# Altium project TapBand.PrjPcb
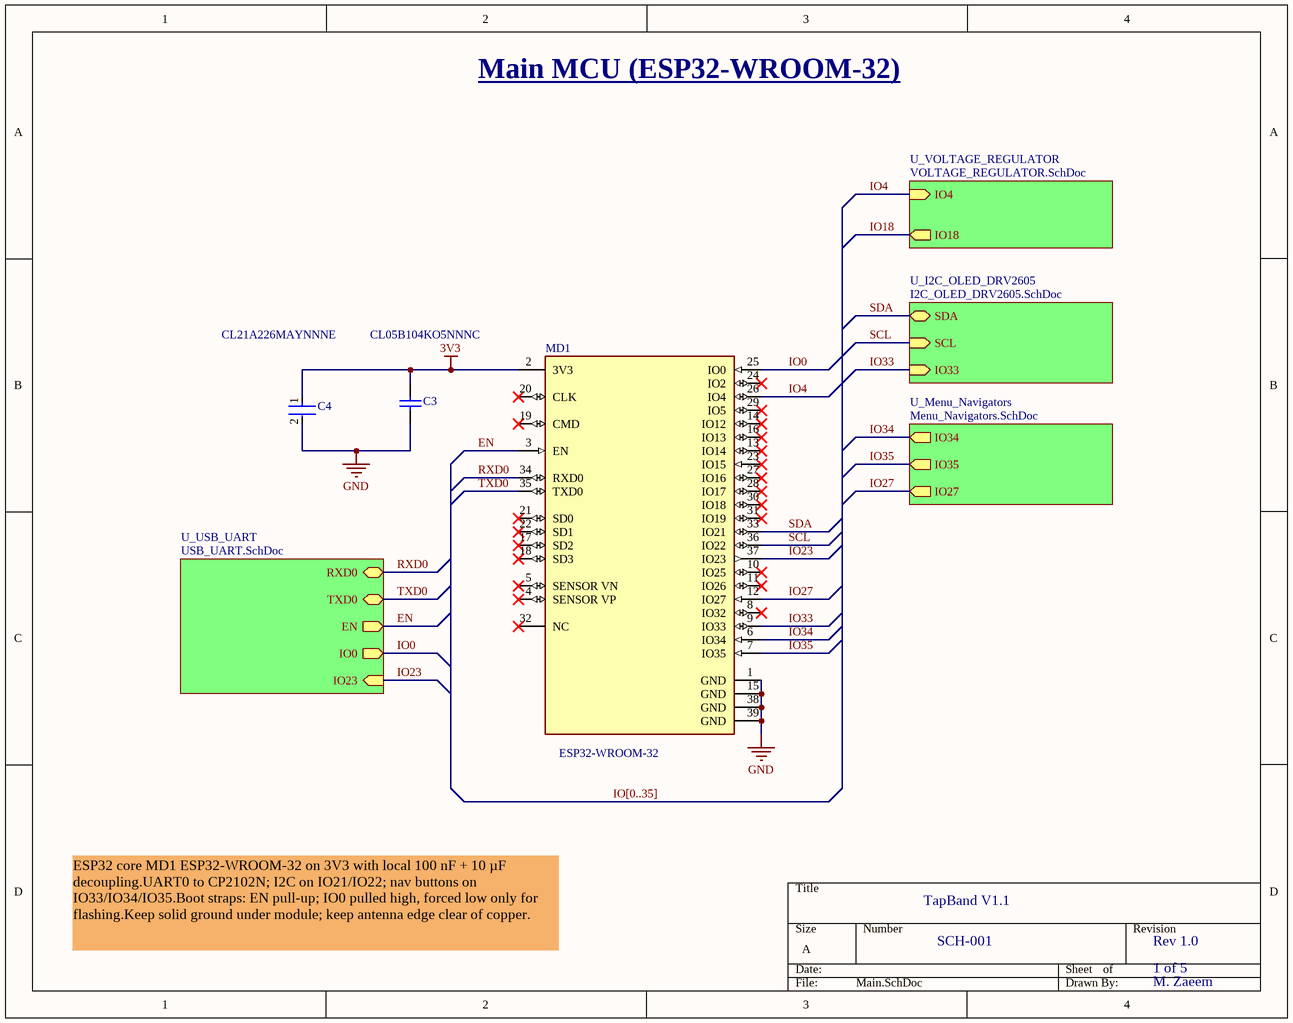
[diagram p0: Main.SchDoc]
5 sheets, 73 parts. Net scope: hierarchical (ports join the sheet entries above them; power ports are global).
Board file: TapBand.PcbDoc
Sheets:
  Main.SchDoc
    U_I2C_OLED_DRV2605 = I2C_OLED_DRV2605.SchDoc
    U_Menu_Navigators = Menu_Navigators.SchDoc
    U_USB_UART = USB_UART.SchDoc
    U_VOLTAGE_REGULATOR = VOLTAGE_REGULATOR.SchDoc

## Sheet Main.SchDoc
size A; SheetNumber: 1; SheetTotal: 5

### Parts
C3  CL05B104KO5NNNC  [CAPC1050X55X23ML05T13]
C4  CL21A226MAYNNNE  [FP-CL21-IPC_C]
MD1  ESP32-WROOM-32  [FP-ESP32-WROOM-32-MFG]

### Sub-sheets
U_I2C_OLED_DRV2605 = I2C_OLED_DRV2605.SchDoc: SDA (bidir), SCL (in), IO33 (in)
U_Menu_Navigators = Menu_Navigators.SchDoc: IO27 (out), IO34 (out), IO35 (out)
U_USB_UART = USB_UART.SchDoc: IO0 (out), EN (out), IO23 (in), RXD0 (bidir), TXD0 (bidir)
U_VOLTAGE_REGULATOR = VOLTAGE_REGULATOR.SchDoc: IO4 (in), IO18 (out)

### Nets
3V3: C3.2 C4.1 MD1.2(3V3)
GND: C3.1 C4.2 MD1.1(GND) MD1.15(GND) MD1.38(GND) MD1.39(GND)
EN: MD1.3(EN) ; sheet U_USB_UART/EN
IO0: MD1.25(IO0) ; sheet U_USB_UART/IO0
IO4: MD1.26(IO4) ; sheet U_VOLTAGE_REGULATOR/IO4
IO23: MD1.37(IO23) ; sheet U_USB_UART/IO23
IO27: MD1.12(IO27) ; sheet U_Menu_Navigators/IO27
IO33: MD1.9(IO33) ; sheet U_I2C_OLED_DRV2605/IO33
IO34: MD1.6(IO34) ; sheet U_Menu_Navigators/IO34
IO35: MD1.7(IO35) ; sheet U_Menu_Navigators/IO35
RXD0: MD1.34(RXD0) ; sheet U_USB_UART/RXD0
SCL: MD1.36(IO22) ; sheet U_I2C_OLED_DRV2605/SCL
SDA: MD1.33(IO21) ; sheet U_I2C_OLED_DRV2605/SDA
TXD0: MD1.35(TXD0) ; sheet U_USB_UART/TXD0

Not connected (* = marked no-connect by the designer): MD1 4(SENSOR_VP)* 5(SENSOR_VN)* 8(IO32)* 10(IO25)* 11(IO26)* 13(IO14)* 14(IO12)* 16(IO13)* 17(SD2)* 18(SD3)* 19(CMD)* 20(CLK)* 21(SD0)* 22(SD1)* 23(IO15)* 24(IO2)* 27(IO16)* 28(IO17)* 29(IO5)* 30(IO18)* 31(IO19)* 32(NC)*

### Buses and harness runs
bus IO[0..35]

### Notes on the sheet
- Main MCU (ESP32-WROOM-32)
- TapBand V1.1
- ESP32 core MD1 ESP32‑WROOM‑32 on 3V3 with local 100 nF + 10 µF decoupling.UART0 to CP2102N; I2C on IO21/IO22; nav buttons on IO33/IO34/IO35.Boot straps: EN pull‑up; IO0 pulled high, forced low only for flashing.Keep solid ground under module; keep antenna edge clear of copper.
- SCH-001
- Rev 1.0
- 1 of 5
- M. Zaeem

### Library data of the parts
C3 = CMP-2000-05439-1: Chip Capacitor, 100 nF, +/- 10%, 16 V, -55 to 125 degC, 0402 (1005 Metric), RoHS, Tape and Reel; Manufacturer: Samsung Electro-Mechanics; Capacitance: 100000pF; Dielectric: X7R; Rated Voltage: 16V; Case Size/Dimension: 0402; Tolerance (%): ±10%; Manufacturer URL: http://www.samsungsem.com/global/index.jsp; Datasheet URL: https://datasheet.ciiva.com/29198/458718-da-01-en-vs-kondensator-0402-29198423.pdf; Datasheet Version: Nov-10
C4 = CMP-13271-003225-1: CL21 Series 0805 22uF 25V ±20% Tolerance X5R Multilayer Ceramic Chip Capacitor
MD1 = CMP-194065-000008-1: RX TXRX MOD WIFI SURFACE MOUNT; Frequency: 2.5GHz; Sensitivity: -98dBm; Operating Supply Voltage: 3.6V; Data Rate: 150Mbps; Weight: 0.088185oz; Package Quantity: 550; Min Operating Temperature: -40°C; Mount: Surface Mount; Max Operating Temperature: 85°C; Packaging: Cut Tape; Case/Package: SMD/SMT

## Sheet I2C_OLED_DRV2605.SchDoc
size A; SheetNumber: 2; SheetTotal: 5
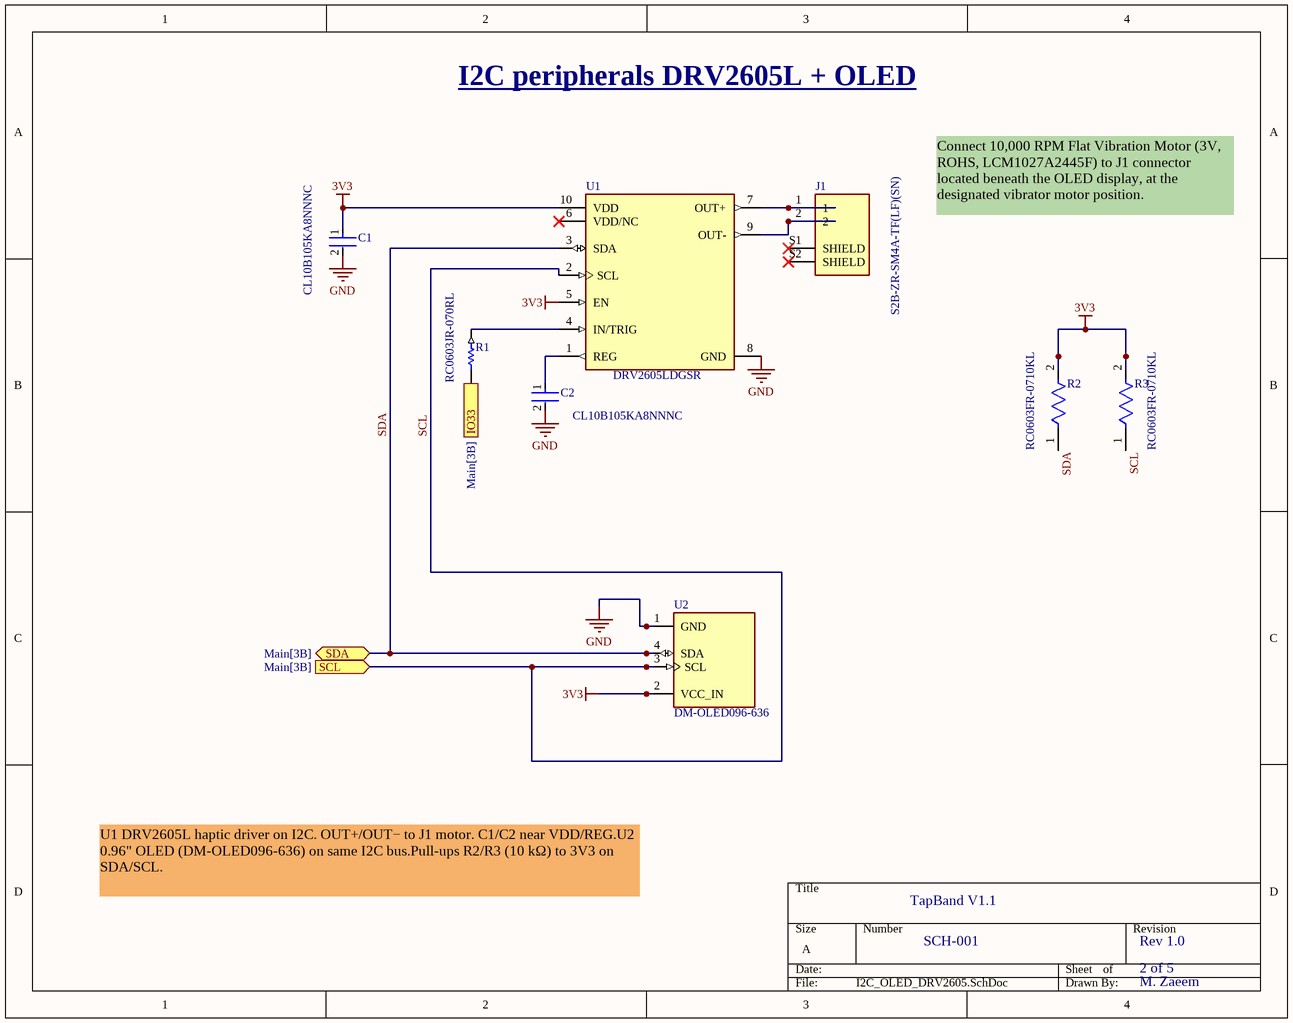
[diagram p1: I2C_OLED_DRV2605.SchDoc]

### Parts
C1  CL10B105KA8NNNC  [FP-CL10-IPC_C]
C2  CL10B105KA8NNNC  [FP-CL10-IPC_C]
J1  S2B-ZR-SM4A-TF(LF)(SN)  [JST_S2B-ZR-SM4A-TF(LF)(SN)]
R1  RC0603JR-070RL  [RESC1608X55X25ML10T15]
R2  RC0603FR-0710KL  [FP-RC0603-0_55-IPC_C]
R3  RC0603FR-0710KL  [FP-RC0603-0_55-IPC_C]
U1  DRV2605LDGSR  [FP-DGS0010A-MFG]
U2  DM-OLED096-636  [MODULE_DM-OLED096-636]

### Ports
IO33 (in, see Main[3B]), SCL (in, see Main[3B]), SDA (bidir, see Main[3B])

### Nets
3V3: C1.1 R2.2 R3.2 U1.5(EN) U1.10(VDD) U2.2(VCC_IN)
GND: C1.2 C2.2 U1.8(GND) U2.1(GND)
IO33: R1.2 ; port IO33
SCL: R3.1 U1.2(SCL) U2.3(SCL) ; port SCL
SDA: R2.1 U1.3(SDA) U2.4(SDA) ; port SDA
NetC2_1: C2.1 U1.1(REG)
NetJ1_1: J1.1 U1.7(OUT+)
NetJ1_2: J1.2 U1.9(OUT-)
NetR1_1: R1.1 U1.4(IN/TRIG)

Not connected (* = marked no-connect by the designer): J1 S1(SHIELD)* S2(SHIELD)*; U1 6(VDD/NC)*

### Notes on the sheet
- I2C peripherals DRV2605L + OLED
- Connect 10,000 RPM Flat Vibration Motor (3V, ROHS, LCM1027A2445F) to J1 connector located beneath the OLED display, at the designated vibrator motor position.
- U1 DRV2605L haptic driver on I2C. OUT+/OUT− to J1 motor. C1/C2 near VDD/REG.U2 0.96" OLED (DM‑OLED096‑636) on same I2C bus.Pull‑ups R2/R3 (10 kΩ) to 3V3 on SDA/SCL.
- TapBand V1.1
- SCH-001
- Rev 1.0
- 2 of 5
- M. Zaeem

### Library data of the parts
C1 C2 = CMP-13271-000007-2: CAP CER 1UF 25V X7R 0603; Tolerance: 10%; Width: 0.031inch; Packaging: Tape and Reel; Package Quantity: 1; Case/Package: 0603; Series: CL; Case Code (Imperial): 0603; Radiation Hardening: No; Thickness: 0.035inch; Case Code (Metric): 1608; Min Operating Temperature: -55°C; Depth: 0.8mm; RoHS Compliant: Yes; Height: 0.8mm; Capacitance: 1uF; Mount: Surface Mount; Construction: Flat; Length: 1.6mm; Max Operating Temperature: 125°C; Voltage: 25V; Dielectric: X7R; Contact Plating: Tin; Voltage Rating: 25V
J1 = S2B-ZR-SM4A-TF(LF)(SN): Connector Header Surface Mount, Right Angle 2 position 0.059 (1.50mm); MF: JST Sales; SnapEDA_Link: https://www.snapeda.com/parts/S2B-ZR-SM4A-TF%20(LF)(SN)/JST/view-part/?ref=snap; Package: None; Value: *; MP: S2B-ZR-SM4A-TF (LF)(SN); Check_prices: https://www.snapeda.com/parts/S2B-ZR-SM4A-TF%20(LF)(SN)/JST/view-part/?ref=eda
R1 = CMP-2100-03667-1: Chip Resistor, 0 Ohm, +/- 5%, 0.1 W, -55 to 155 degC, 0603 (1608 Metric), RoHS, Tape and Reel; Manufacturer: Yageo; Temperature Coefficient: 200ppm/degreesC; Voltage Rating: 50V; Power Rating: 100mW; Resistance: 0mOhm; Width: 0.8mm; Max Operating Temperature: 155degC; Tolerance: 5%; Package Reference: 0603; Height: 0.45mm; Depth: 0.8mm; Package Description: 2-Pin Surface Mount Device, Body 1.6 x 0.8 mm; Termination: SMD/SMT; Package Quantity: 5000; Case/Package: 0603; Case Code (Imperial): 0603; Radiation Hardening: No; Number of Pins: 2; Length: 1.6mm; Lead Free: LeadFree; Voltage Rating (DC): 50V; Military Standard: Not; Datasheet URL: http://www.yageo.com/NewPortal/yageodocoutput?fileName=/pdf/R-Chip/PYu-RC_Group_51_RoHS_L_5.pdf; Manufacturer URL: http://www.yageo.com/; Packaging: TapeandReel; Case Code (Metric): 1608; Min Operating Temperature: -55degC; Composition: ThickFilm; RoHSCompliant: true; Contact Plating: Tin; Datasheet Version: Rev. 5, 10/2016; REACH SVHC: NoSVHC
R2 R3 = CMP-2100-03664-2: RES 10K OHM 1% 1/10W 0603; Voltage Rating: 75V; Voltage Rating (DC): 50V; Resistance: 10kR; Power Rating: 100mW; Temperature Coefficient: 100ppm/°C; Depth: 0.8mm; Termination: SMD/SMT; Resistor Type: Thick Film; Series: RC; Construction: Rectangular; Features: Moisture Resistant; Packaging: Tape and Reel; Min Operating Temperature: -55°C; Number of Terminations: 2; Lead Pitch: 0.3mm; RoHS Compliant: Yes; Case/Package: 0603; Resistance Tolerance: 1%; Military Standard: Not; Weight: 7.1E-05oz; Number of Pins: 2; Tolerance: 1%; Length: 1.6mm; Case Code (Imperial): 0603; Lead Free: Lead Free; Width: 0.8mm; Max Power Dissipation: 100mW; Height: 0.45mm; Max Operating Temperature: 155°C; Case Code (Metric): 1608; Size Code: 0603
U1 = CMP-04915-000060-1: IC MOTOR DRIVER 2V-5.5V 10VSSOP; Logic Function: AND GATE; Quiescent Current: 500uA; Interface: I2C; RoHS Compliant: Yes; Min Operating Temperature: -40°C; Max Operating Temperature: 85°C; Packaging: Tape and Reel; Lead Free: Lead Free; Case/Package: VSSOP; Mount: Surface Mount
U2 = DM-OLED096-636: 0.96â€ 128 X 64 MONOCHROME GRAPHIC OLED DISPLAY MODULE - I2C; SnapEDA_Link: https://www.snapeda.com/parts/DM-OLED096-636/Display+Module/view-part/?ref=snap; Package: Package; Value: *; MF: Display Module; MP: DM-OLED096-636; Check_prices: https://www.snapeda.com/parts/DM-OLED096-636/Display+Module/view-part/?ref=eda

## Sheet Menu_Navigators.SchDoc
size A; SheetNumber: 5; SheetTotal: 5
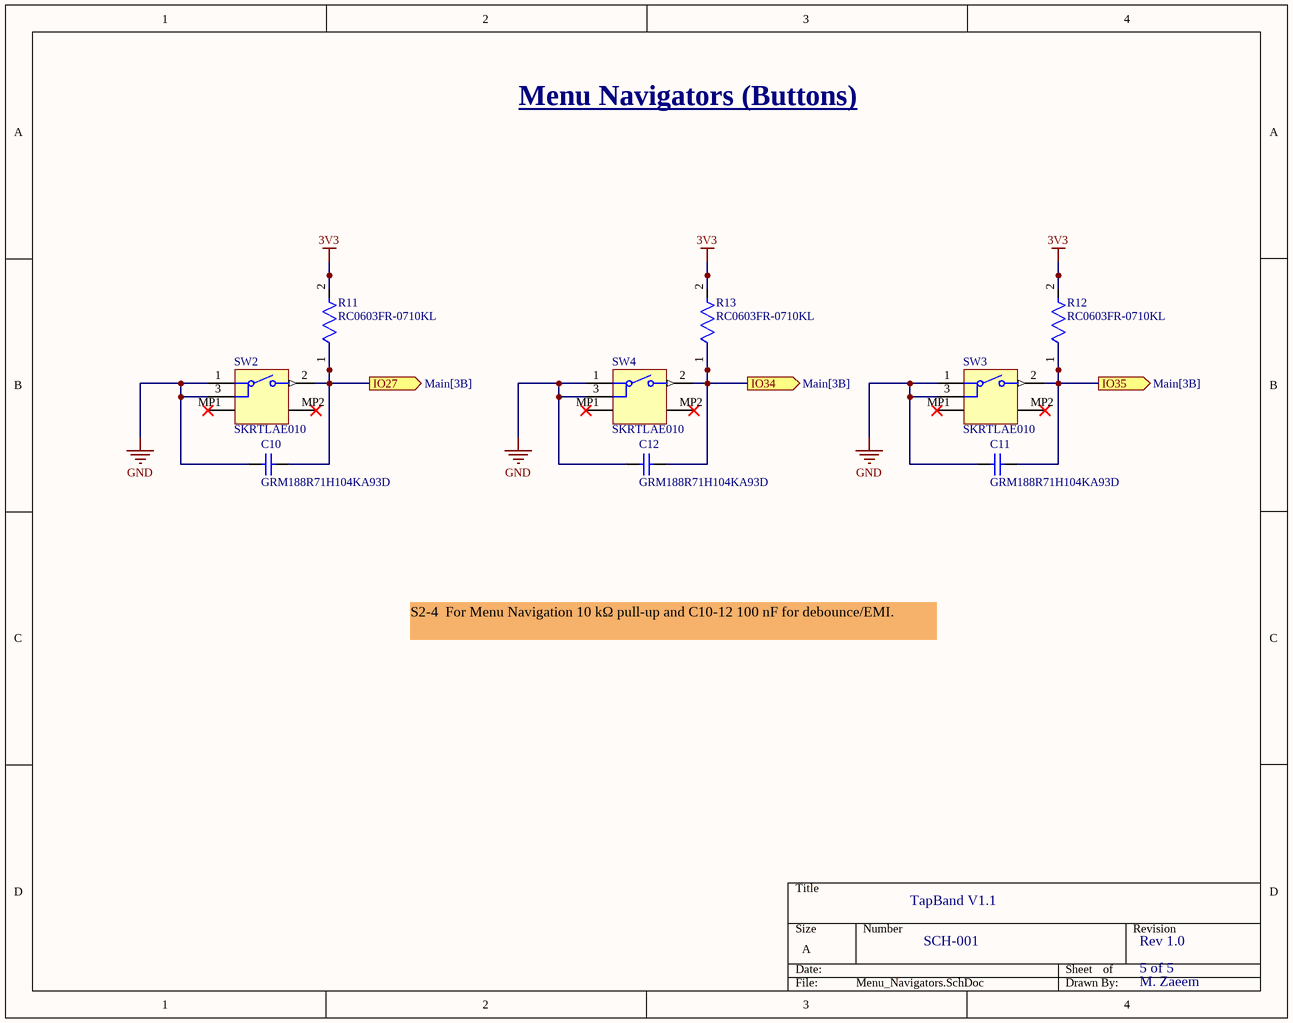
[diagram p2: Menu_Navigators.SchDoc]

### Parts
C10  GRM188R71H104KA93D  [CAPC1608X90X35ML10T15]
C11  GRM188R71H104KA93D  [CAPC1608X90X35ML10T15]
C12  GRM188R71H104KA93D  [CAPC1608X90X35ML10T15]
R11  RC0603FR-0710KL  [FP-RC0603-0_55-IPC_C]
R12  RC0603FR-0710KL  [FP-RC0603-0_55-IPC_C]
R13  RC0603FR-0710KL  [FP-RC0603-0_55-IPC_C]
SW2  SKRTLAE010  [ALPS-SKRTLAE010_V]
SW3  SKRTLAE010  [ALPS-SKRTLAE010_V]
SW4  SKRTLAE010  [ALPS-SKRTLAE010_V]

### Ports
IO27 (out, see Main[3B]), IO34 (out, see Main[3B]), IO35 (out, see Main[3B])

### Nets
3V3: R11.2 R12.2 R13.2
GND: C10.2 C11.2 C12.2 SW2.1 SW2.3 SW3.1 SW3.3 SW4.1 SW4.3
IO27: C10.1 R11.1 SW2.2 ; port IO27
IO34: C12.1 R13.1 SW4.2 ; port IO34
IO35: C11.1 R12.1 SW3.2 ; port IO35

Not connected (* = marked no-connect by the designer): SW2 MP1* MP2*; SW3 MP1* MP2*; SW4 MP1* MP2*

### Notes on the sheet
- Menu Navigators (Buttons)
- S2-4  For Menu Navigation 10 kΩ pull‑up and C10-12 100 nF for debounce/EMI.
- TapBand V1.1
- SCH-001
- Rev 1.0
- 5 of 5
- M. Zaeem

### Library data of the parts
C10-C12 = CMP-2100-03643-1: Chip Capacitor, 0.1 uF, +/- 10%, 50 V, -55 to 125 degC, 0603 (1608 Metric), RoHS, Tape and Reel; Manufacturer: Murata; Dielectric Material: Ceramic; Voltage Rating: 50V; Capacitance: 100nF; Dielectric: X7R; Insulation Resistance: 10GR; Case Code (Metric): 1608; Lead Free: LeadFree; Depth: 0.8mm; Number of Pins: 2; Radiation Hardening: No; Case/Package: 0603; Manufacturer URL: http://www.murata.com/; Packaging: TapeandReel; Length: 1.6mm; Contact Plating: Tin; Datasheet URL: http://psearch.en.murata.com/capacitor/product/GRM188R71H104KA93%23.pdf; Tolerance: 10%; Case Code (Imperial): 0603; Min Operating Temperature: -55degC; RoHSCompliant: true; Voltage: 50V; Termination: SMD/SMT; Mount: SurfaceMount; Material: Ceramic; Package Quantity: 1; Height: 0.8mm; Thickness: 0.035inch; REACH SVHC: NoSVHC; Max Operating Temperature: 125degC; Width: 0.8mm; Package Reference: 0603; Voltage Rating (DC): 50V; Datasheet Version: 42675.0; Package Description: 2-Pin Surface Mount Device, Body 1.6 x 0.8 mm
R11-R13 = CMP-2100-03664-2: as R2 on sheet I2C_OLED_DRV2605; Depth: 0.8mm; Termination: SMD/SMT; Resistor Type: Thick Film; Series: RC; Construction: Rectangular; Features: Moisture Resistant; Packaging: Tape and Reel; Min Operating Temperature: -55°C; Number of Terminations: 2; Lead Pitch: 0.3mm; RoHS Compliant: Yes; Case/Package: 0603; Resistance Tolerance: 1%; Military Standard: Not; Weight: 7.1E-05oz; Number of Pins: 2; Tolerance: 1%; Length: 1.6mm; Case Code (Imperial): 0603; Lead Free: Lead Free; Width: 0.8mm; Max Power Dissipation: 100mW; Height: 0.45mm; Max Operating Temperature: 155°C; Case Code (Metric): 1608; Size Code: 0603
SW2-SW4 = CMP-2000-07073-2: Side Push Type, 250 V, -40 to 90 degC, 3-Pin SMD, RoHS, Tape and Reel; Manufacturer: ALPS; Operating Force: 1.6N; Folder: Unified Components\Components\New Releases\New\; Maximum Current Rating: 0.05@12VDCA; RevisionId: 1; Pole Throw Configuration: SPST; Switch Configuration: N.O.; AccessRights: 2147483647; Maximum DC Voltage Rating: 12V; ContentType: Unified Component; Rad Hard: No; Mounting: SurfaceMount; Datasheet URL: http://www.alps.com/prod/info/E/PDF/Tact/SurfaceMount/SKRT/SKRT.PDF; Manufacturer URL: http://www.alps.com/e/; ReleaseDate: 22/09/2017 06:13:25 AM; ItemHRID: CMP-2000-07073; ContentTypeGUID: CB3C11C4-E317-11DF-B822-12313F0024A2; LifeCycle: Released; ItemGUID: EAC55BEC-37DC-4BDB-8BA7-D75E6D5C3D75; Packaging: Tape&Reel; Package Reference: SKRTLAE010; FolderGUID: B7F4506A-9127-42E7-A087-46FE7B18D116; Datasheet Version: 06/2015; Mounting Technology: SurfaceMount; LifeCycleStateGUID: 61E382EE-6656-4F12-9E24-BE9327104A25; Package Description: 3-Pin Surface Mount Device, Body 4.5 x 3.55 mm, Pitch 1.225 mm

## Sheet USB_UART.SchDoc
size A; SheetNumber: 3; SheetTotal: 5
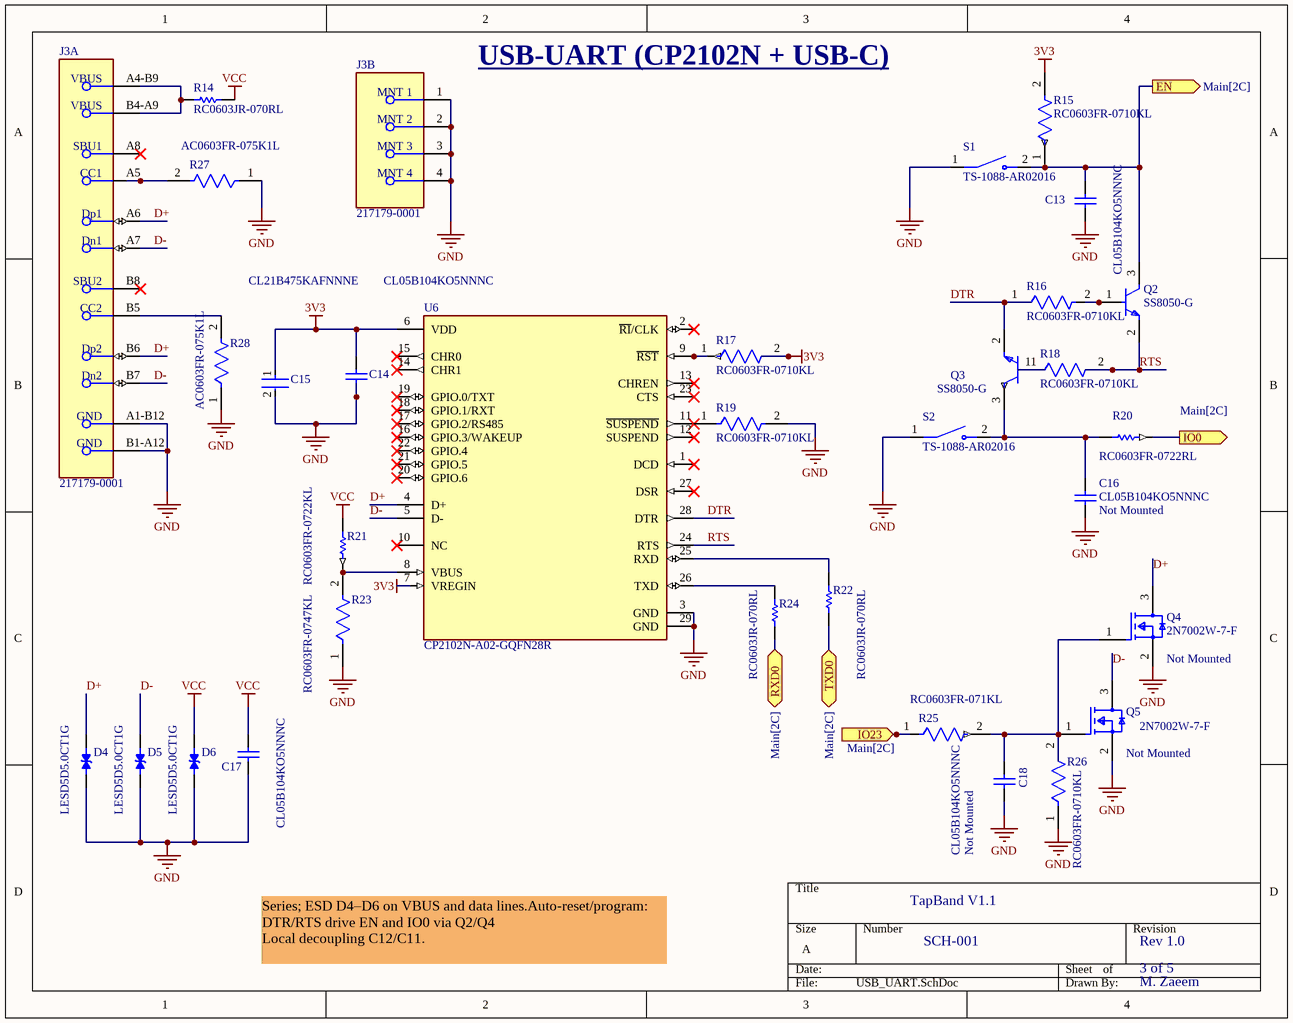
[diagram p3: USB_UART.SchDoc]

### Parts
C13  CL05B104KO5NNNC  [CAPC1050X55X23ML05T13]
C14  CL05B104KO5NNNC  [CAPC1050X55X23ML05T13]
C15  CL21B475KAFNNNE  [FP-CL21-IPC_C]
C16  CL05B104KO5NNNC  Fitted: Not Mounted  [CAPC1050X55X23ML05T13]
C17  CL05B104KO5NNNC  [CAPC1050X55X23ML05T13]
C18  CL05B104KO5NNNC  Fitted: Not Mounted  [CAPC1050X55X23ML05T13]
D4  LESD5D5.0CT1G  [TVS_LESD5D5.0CT1G]
D5  LESD5D5.0CT1G  [TVS_LESD5D5.0CT1G]
D6  LESD5D5.0CT1G  [TVS_LESD5D5.0CT1G]
J3  217179-0001  [FP-2171790001-MFG]  (parts A,B of 2)
Q2  SS8050-G  [FP-SS8050-G-MFG]
Q3  SS8050-G  [FP-SS8050-G-MFG]
Q4  2N7002W-7-F  Fitted: Not Mounted  [FP-SOT323-IPC_C]
Q5  2N7002W-7-F  Fitted: Not Mounted  [FP-SOT323-IPC_C]
R14  RC0603JR-070RL  [RESC1608X55X25ML10T15]
R15  RC0603FR-0710KL  [FP-RC0603-0_55-IPC_C]
R16  RC0603FR-0710KL  [FP-RC0603-0_55-IPC_C]
R17  RC0603FR-0710KL  [FP-RC0603-0_55-IPC_C]
R18  RC0603FR-0710KL  [FP-RC0603-0_55-IPC_C]
R19  RC0603FR-0710KL  [FP-RC0603-0_55-IPC_C]
R20  RC0603FR-0722RL  [RESC1608X55X25NL10T15]
R21  RC0603FR-0722KL  [RESC1608X55X25LL10T15]
R22  RC0603JR-070RL  [RESC1608X55X25ML10T15]
R23  RC0603FR-0747KL  [FP-RC0603FR-0747KL-MFG]
R24  RC0603JR-070RL  [RESC1608X55X25ML10T15]
R25  RC0603FR-071KL  [FP-RC0603-0_55-IPC_C]
R26  RC0603FR-0710KL  [FP-RC0603-0_55-IPC_C]
R27  AC0603FR-075K1L  [FP-AC0603-MFG]
R28  AC0603FR-075K1L  [FP-AC0603-MFG]
S1  TS-1088-AR02016  [SW_TS-1088-AR02016]
S2  TS-1088-AR02016  [SW_TS-1088-AR02016]
U6  CP2102N-A02-GQFN28R  [FP-CP2102N-A02-GQFN28R-MFG]

### Ports
EN (out, see Main[2C]), IO0 (out, see Main[2C]), IO23 (in, see Main[2C]), RXD0 (bidir, see Main[2C]), TXD0 (bidir, see Main[2C])

### Nets
3V3: C14.2 C15.1 R15.2 R17.2 U6.6(VDD) U6.7(VREGIN)
GND: C13.1 C14.1 C15.2 C16.2 C17.1 C18.1 D4.2 D5.2 D6.2 J3.1(MNT_1) J3.2(MNT_2) J3.3(MNT_3) J3.4(MNT_4) J3.A1-B12(GND) J3.B1-A12(GND) Q4.2(S) Q5.2(S) R19.2 R23.1 R26.1 R27.1 R28.1 S1.1 S2.1 U6.3(GND) U6.29(GND)
VCC: C17.2 D6.1 R14.1 R21.1
D+: D4.1 J3.A6(Dp1) J3.B6(Dp2) Q4.3(D) U6.4(D+)
D-: D5.1 J3.A7(Dn1) J3.B7(Dn2) Q5.3(D) U6.5(D-)
DTR: Q3.2(E) R16.1 U6.28(DTR)
EN: C13.2 Q2.3(C) R15.1 S1.2 ; port EN
IO0: R20.2 ; port IO0
IO23: R25.1 ; port IO23
RTS: Q2.2(E) R18.2 U6.24(RTS)
RXD0: R24.1 ; port RXD0
TXD0: R22.1 ; port TXD0
NetC16_1: C16.1 Q3.3(C) R20.1 S2.2
NetC18_2: C18.2 Q4.1(G) Q5.1(G) R25.2 R26.2
NetJ3_A4-B9: J3.A4-B9(VBUS) J3.B4-A9(VBUS) R14.2
NetJ3_A5: J3.A5(CC1) R27.2
NetJ3_B5: J3.B5(CC2) R28.2
NetQ2_1: Q2.1(B) R16.2
NetQ3_1: Q3.1(B) R18.1
NetR17_1: R17.1 U6.9(~{RST})
NetR19_1: R19.1 U6.11(~{SUSPEND})
NetR21_2: R21.2 R23.2 U6.8(VBUS)
NetR22_2: R22.2 U6.25(RXD)
NetR24_2: R24.2 U6.26(TXD)

Not connected (* = marked no-connect by the designer): J3 A8(SBU1)* B8(SBU2)*; U6 1(DCD)* 2(~{RI}/CLK)* 10(NC)* 12(SUSPEND)* 13(CHREN)* 14(CHR1)* 15(CHR0)* 16(GPIO.3/WAKEUP)* 17(GPIO.2/RS485)* 18(GPIO.1/RXT)* 19(GPIO.0/TXT)* 20(GPIO.6)* 21(GPIO.5)* 22(GPIO.4)* 23(CTS)* 27(DSR)*

### Notes on the sheet
- USB‑UART (CP2102N + USB‑C)
- TapBand V1.1
- Series; ESD D4–D6 on VBUS and data lines.Auto‑reset/program: DTR/RTS drive EN and IO0 via Q2/Q4
  Local decoupling C12/C11.
- SCH-001
- Rev 1.0
- 3 of 5
- M. Zaeem

### Library data of the parts
C13 C14 C16-C18 = CMP-2000-05439-1: as C3 on sheet Main; Case Size/Dimension: 0402; Tolerance (%): ±10%; Manufacturer URL: http://www.samsungsem.com/global/index.jsp; Datasheet URL: https://datasheet.ciiva.com/29198/458718-da-01-en-vs-kondensator-0402-29198423.pdf; Datasheet Version: Nov-10
C15 = CMP-13271-001003-1: CL21 Series 0805 4.7uF 25V ±10% Tolerance X7R Multilayer Ceramic Chip Capacitor; Length: 0.079inch; Capacitance: 4.7uF; Max Operating Temperature: 125°C; Mount: Surface Mount; Voltage Rating (DC): 25V; Width: 0.049inch; Min Operating Temperature: -55°C; Lead Free: Lead Free; Case Code (Metric): 2012; Case/Package: 0805; Case Code (Imperial): 0805; Tolerance: 10%; Thickness: 0.053inch; Voltage Rating: 25V; Packaging: Tape and Reel
D4-D6 = LESD5D5.0CT1G: Transient Voltage Suppressors for ESD Protection; MF: Leshan Radio Co.; Check_prices: https://www.snapeda.com/parts/LESD5D5.0CT1G/Leshan+Radio+Co./view-part/?ref=eda; Value: *; Availability: Not in stock; Package: None; SnapEDA_Link: https://www.snapeda.com/parts/LESD5D5.0CT1G/Leshan+Radio+Co./view-part/?ref=snap; MP: LESD5D5.0CT1G; Price: None
J3 = CMP-04767-000028-2: CONN RCP USB2.0 TYP C 24P SMD RA; NexarPartId: 117190526; Gender: Receptacle; Number of Contacts: 16; Current Rating: 1.25A; Voltage Rating: 30V; Min Operating Temperature: -40°C; USB Standard: USB 2.0; Height: 3.36mm; Contact Material: Gold, Nickel; Max Operating Temperature: 85°C
Q2 Q3 = CMP-20235-000001-1: NPN TRANSISTOR 1.5A 40V SOT-23 R; Transition Frequency: 100MHz; Max Breakdown Voltage: 25V; Collector Emitter Voltage (VCEO): 400mV; Max Power Dissipation: 300mW; Max Collector Current: 1.5A; Case/Package: TO-236-3; Packaging: Tape and Reel; RoHS Compliant: Yes; Mount: Surface Mount; Collector Emitter Breakdown Voltage: 25V
Q4 Q5 = CMP-2000-05568-2: MOSFET N-CH 60V 115MA SOT323; Element Configuration: Single; Nominal Vgs: 2V; Drain to Source Breakdown Voltage: 70V; Drain to Source Resistance: 2.6R; Input Capacitance: 50pF; On-State Resistance: 7.5R; Number of Channels: 1; Power Dissipation: 200mW; Turn-Off Delay Time: 11ns; Turn-On Delay Time: 7ns; Gate to Source Voltage (Vgs): 20V; Dual Supply Voltage: 60V; Contact Plating: Tin; Min Operating Temperature: -55°C; Radiation Hardening: No; Drain to Source Voltage (Vdss): 60V; Height: 1mm; Max Operating Temperature: 150°C; Voltage Rating (DC): 60V; Case/Package: SOT-323; Weight: 0.000212oz; Mount: Surface Mount; Length: 2.2mm; Lead Free: Lead Free; Threshold Voltage: 2V; Packaging: Tape and Reel; Max Power Dissipation: 200mW; Package Quantity: 1; Continuous Drain Current (ID): 115mA; Number of Pins: 3; Width: 1.35mm; Current Rating: 115mA; Rds On Max: 7.5R; REACH SVHC: No SVHC; Termination: SMD/SMT; Number of Elements: 1
R14 R22 R24 = CMP-2100-03667-1: as R1 on sheet I2C_OLED_DRV2605; Width: 0.8mm; Max Operating Temperature: 155degC; Tolerance: 5%; Package Reference: 0603; Height: 0.45mm; Depth: 0.8mm; Package Description: 2-Pin Surface Mount Device, Body 1.6 x 0.8 mm; Termination: SMD/SMT; Package Quantity: 5000; Case/Package: 0603; Case Code (Imperial): 0603; Radiation Hardening: No; Number of Pins: 2; Length: 1.6mm; Lead Free: LeadFree; Voltage Rating (DC): 50V; Military Standard: Not; Datasheet URL: http://www.yageo.com/NewPortal/yageodocoutput?fileName=/pdf/R-Chip/PYu-RC_Group_51_RoHS_L_5.pdf; Manufacturer URL: http://www.yageo.com/; Packaging: TapeandReel; Case Code (Metric): 1608; Min Operating Temperature: -55degC; Composition: ThickFilm; RoHSCompliant: true; Contact Plating: Tin; Datasheet Version: Rev. 5, 10/2016; REACH SVHC: NoSVHC
R15-R19 R26 = CMP-2100-03664-2: as R2 on sheet I2C_OLED_DRV2605; Depth: 0.8mm; Termination: SMD/SMT; Resistor Type: Thick Film; Series: RC; Construction: Rectangular; Features: Moisture Resistant; Packaging: Tape and Reel; Min Operating Temperature: -55°C; Number of Terminations: 2; Lead Pitch: 0.3mm; RoHS Compliant: Yes; Case/Package: 0603; Resistance Tolerance: 1%; Military Standard: Not; Weight: 7.1E-05oz; Number of Pins: 2; Tolerance: 1%; Length: 1.6mm; Case Code (Imperial): 0603; Lead Free: Lead Free; Width: 0.8mm; Max Power Dissipation: 100mW; Height: 0.45mm; Max Operating Temperature: 155°C; Case Code (Metric): 1608; Size Code: 0603
R20 = CMP-1659-00033-1: Chip Resistor, 22 Ohm, +/- 1%, 0.1 W, -55 to 155 degC, 0603 (1608 Metric), RoHS, Tape and Reel; Max Ouput Current: 8 A; Case\Package: SIP; Max Input Voltage: 1.4 V; ComponentLink2URL: http://www.yageo.com/documents/recent/PYu-RC_Group_51_RoHS_L_04.pdf; RoHSCompliant: true; Max Operating Temperature: 100 degC; PackageDescription: 2-Pin Surface Mount Device, Body 1.6 x 0.8 mm; ComponentLink1Description: Manufacturer URL; ComponentLink1URL: http://www.yageo.com/; Length: 18.5 mm; REACH SVHC: Unknown; Pins: 4; DatasheetVersion: Rev. 4, 02/2016; PackageReference: 0603; Output Current: 8 A; Min Operating Temperature: -25 degC; Height: 19.6 mm; Mount: Through Hole; Radiation Hardening: No; ComponentLink2Description: Datasheet; Package Quantity: 200; Packaging: Rail/Tube
R21 = CMP-1012-00659-3: Chip Resistor, 22 KOhm, +/- 1%, 0.1 W, -55 to 155 degC, 0603 (1608 Metric), RoHS, Tape and Reel; Tolerance: 10%; Current Rating: 290 mA; Shielding: Unshielded; Resistance: 2.9 Ohm; PackageReference: 0603; PackageDescription: 2-Pin Surface Mount Device, Body 1.6 x 0.8 mm; ComponentLink2URL: http://www.yageo.com/documents/recent/PYu-RC_Group_51_RoHS_L_04.pdf; RoHSCompliant: True; REACH SVHC: No SVHC; ComponentLink1Description: Manufacturer URL; ComponentLink2Description: Datasheet; DatasheetVersion: Rev. 4, 02/2016; Min Operating Temperature: -55degC; Pins: 2; Mount: Through Hole; Height: 11 mm; Packaging: Bulk; Radiation Hardening: No; Package Quantity: 100; Diameter: 8.5 mm; Lead Pitch: 5 mm; Case/Package: Radial; Max Operating Temperature: 105degC; ComponentLink1URL: http://www.yageo.com/
R23 = CMP-1659-00055-2: RES SMD 47K OHM 1% 1/10W 0603; Voltage Rating: 50V; Temperature Coefficient: 100ppm/°C; Max Power Dissipation: 100mW; Resistance: 47kR; Voltage Rating (DC): 50V; Min Operating Temperature: -55°C; Packaging: Tape and Reel; Features: Moisture Resistant; Termination: SMD/SMT; Technology: THICK FILM; Lead Free: Lead Free; Max Operating Temperature: 155°C; Width: 0.031inch; Case Code (Metric): 1608; Tolerance: 1%; Package Quantity: 1; Resistor Type: Thick Film; RoHS Compliant: Yes; Case/Package: 0603; Case Code (Imperial): 0603; Resistance Tolerance: 1%; Length: 0.063inch; Series: RC; Number of Pins: 2; Power Rating: 100mW; Number of Terminations: 2; Construction: Rectangular; Height: 0.022inch; Military Standard: Not; Size Code: 0603; Depth: 0.8mm
R25 = CMP-1659-00009-5: RES 1K OHM 1% 1/10W 0603; Resistance: 1kR; Voltage Rating: 50V; Power Rating: 100mW; Temperature Coefficient: 100ppm/°C; Military Standard: Not; REACH SVHC: No SVHC; Size Code: 0603; Features: Moisture Resistant; Number of Terminations: 2; Technology: THICK FILM; Series: RC; Case Code (Metric): 1608; Resistance Tolerance: 1%; Resistor Type: Thick Film; Termination: SMD/SMT; Contact Plating: Tin; Radiation Hardening: No; Min Operating Temperature: -55°C; Max Operating Temperature: 155°C; Packaging: Tape and Reel; Max Power Dissipation: 100mW; RoHS Compliant: Yes; Height: 0.45mm; Lead Free: Lead Free; Case/Package: 0603; Length: 1.6mm; Tolerance: 1%; Case Code (Imperial): 0603; Construction: Rectangular; Depth: 0.8mm
R27 R28 = CMP-03412-025080-2: RES 5.1KΩ 1.00% 0.1W 0603; Voltage Rating: 50V; Temperature Coefficient: 100ppm/°C; Resistance: 5.1kR; Max Power Dissipation: 100mW; Tolerance: 1%; Max Operating Temperature: 155°C; Min Operating Temperature: -55°C; Ratings: AEC-Q200; Features: Moisture Resistant; RoHS Compliant: Yes; Number of Terminations: 2; Weight: 7.1E-05oz; Case Code (Imperial): 0603; Resistor Type: Thick Film; Length: 1.6mm; Termination: SMD/SMT; Case Code (Metric): 1608; Packaging: Tape and Reel; Width: 0.8mm; Series: AC; Case/Package: 0603; Power Rating: 100mW; Height: 0.45mm
S1 S2 = TS-1088-AR02016: 50mA 4mm 100MÎ© 100,000 Times 12V 160gf 3mm 2mm Round Button Vertical welding SPST SMD Tactile Switches ROHS; MF: Xunpu; SnapEDA_Link: https://www.snapeda.com/parts/TS-1088-AR02016/Xunpu/view-part/?ref=snap; Package: Package; Value: *; MP: TS-1088-AR02016; Check_prices: https://www.snapeda.com/parts/TS-1088-AR02016/Xunpu/view-part/?ref=eda
U6 = CMP-08093-000007-1: IC USB TO UART BRIDGE QFN28

## Sheet VOLTAGE_REGULATOR.SchDoc
size A; SheetNumber: 4; SheetTotal: 5
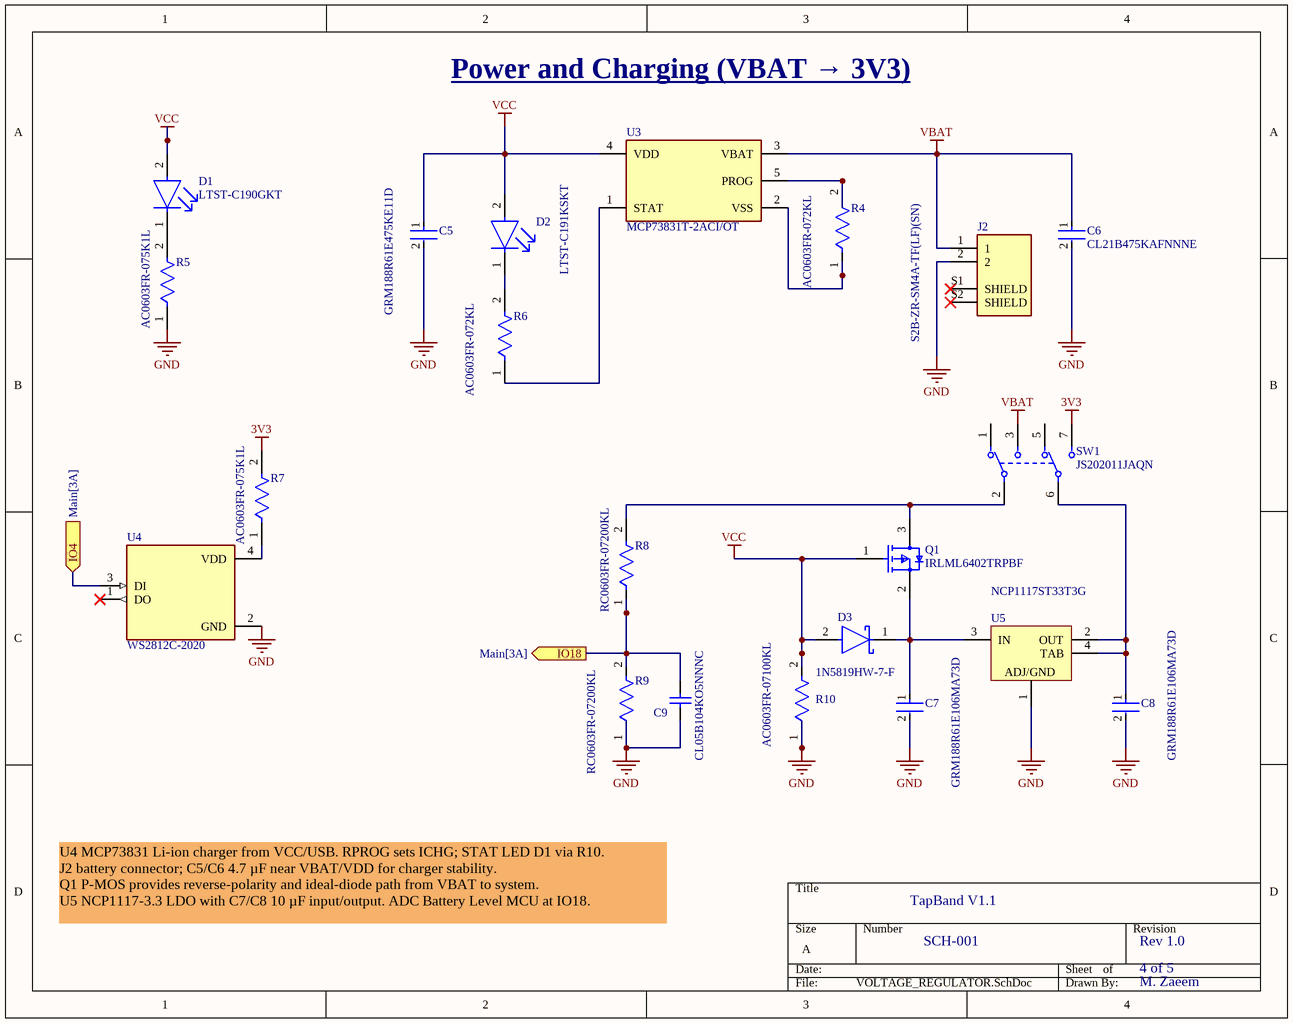
[diagram p4: VOLTAGE_REGULATOR.SchDoc]

### Parts
C5  GRM188R61E475KE11D  [FP-GRM188-0_15-IPC_C]
C6  CL21B475KAFNNNE  [FP-CL21-IPC_C]
C7  GRM188R61E106MA73D  [FP-GRM188-0_2-MFG]
C8  GRM188R61E106MA73D  [FP-GRM188-0_2-MFG]
C9  CL05B104KO5NNNC  [CAPC1050X55X23ML05T13]
D1  LTST-C190GKT  [FP-LTST-C190GKT-MFG]
D2  LTST-C191KSKT  [FP-LTST-C191KSKT-MFG]
D3  1N5819HW-7-F  [FP-SOD123-IPC_A]
J2  S2B-ZR-SM4A-TF(LF)(SN)  [JST_S2B-ZR-SM4A-TF(LF)(SN)]
Q1  IRLML6402TRPBF  [FP-Micro3-MFG]
R4  AC0603FR-072KL  [FP-AC0603-IPC_B]
R5  AC0603FR-075K1L  [FP-AC0603-MFG]
R6  AC0603FR-072KL  [FP-AC0603-IPC_B]
R7  AC0603FR-075K1L  [FP-AC0603-MFG]
R8  RC0603FR-07200KL  [FP-RC0603-0_55-IPC_B]
R9  RC0603FR-07200KL  [FP-RC0603-0_55-IPC_B]
R10  AC0603FR-07100KL  [FP-AC0603-MFG]
SW1  JS202011JAQN  [FP-JS202011JAQN-MFG]
U3  MCP73831T-2ACI/OT  [FP-C04-091-OT-MFG]
U4  WS2812C-2020  [LED_WS2812C-2020]
U5  NCP1117ST33T3G  [ONSC-SOT-223-4-318H-01_A_V]

### Ports
IO4 (in, see Main[3A]), IO18 (out, see Main[3A])

### Nets
3V3: R7.2 SW1.7
GND: C5.2 C6.2 C7.2 C8.2 C9.1 J2.2 R5.1 R9.1 R10.1 U4.2(GND) U5.1(ADJ/GND)
VBAT: C6.1 J2.1 SW1.3 U3.3(VBAT)
VCC: C5.1 D1.2(A) D2.2(A) D3.2(A) Q1.1(G) R10.2 U3.4(VDD)
IO4: U4.3(DI) ; port IO4
IO18: C9.2 R8.1 R9.2 ; port IO18
NetC7_1: C7.1 D3.1(C) Q1.2(S) U5.3(IN)
NetC8_1: C8.1 SW1.6(2_C) U5.2(OUT) U5.4(TAB)
NetD1_1: D1.1(C) R5.2
NetD2_1: D2.1(C) R6.2
NetQ1_3: Q1.3(D) R8.2 SW1.2(1_C)
NetR4_1: R4.1 U3.2(VSS)
NetR4_2: R4.2 U3.5(PROG)
NetR6_1: R6.1 U3.1(STAT)
NetR7_1: R7.1 U4.4(VDD)

Not connected (* = marked no-connect by the designer): J2 S1(SHIELD)* S2(SHIELD)*; SW1 1 5; U4 1(DO)*

### Notes on the sheet
- Power and Charging (VBAT → 3V3)
- TapBand V1.1
- U4 MCP73831 Li‑ion charger from VCC/USB. RPROG sets ICHG; STAT LED D1 via R10.
  J2 battery connector; C5/C6 4.7 µF near VBAT/VDD for charger stability.
  Q1 P‑MOS provides reverse‑polarity and ideal‑diode path from VBAT to system.
  U5 NCP1117‑3.3 LDO with C7/C8 10 µF input/output. ADC Battery Level MCU at IO18.
- SCH-001
- Rev 1.0
- 4 of 5
- M. Zaeem

### Library data of the parts
C5 = CMP-2006-02523-2: Chip Multilayer Ceramic Capacitors for General Purpose, 0603, 4.7uF, X5R, 15%, 10%, 25V; Case Code (Metric): 1608; Max Operating Temperature: 85°C; REACH SVHC: No SVHC; Voltage Rating: 25V; Dielectric: X5R; Packaging: Cut Tape; Width: 0.031inch; Min Operating Temperature: -55°C; Lead Free: Lead Free; Capacitance: 4.7uF; Height: 0.8mm; Case Code (Imperial): 0603; Length: 1.6mm; Voltage Rating (DC): 25V; Case/Package: 0603; Voltage: 25V; Tolerance: 10%; Thickness: 0.031inch; Mount: Surface Mount; Material: Ceramic; Package Quantity: 4000; Depth: 0.8mm
C6 = CMP-13271-001003-1: as C15 on sheet USB_UART; Length: 0.079inch; Capacitance: 4.7uF; Max Operating Temperature: 125°C; Mount: Surface Mount; Voltage Rating (DC): 25V; Width: 0.049inch; Min Operating Temperature: -55°C; Lead Free: Lead Free; Case Code (Metric): 2012; Case/Package: 0805; Case Code (Imperial): 0805; Tolerance: 10%; Thickness: 0.053inch; Voltage Rating: 25V; Packaging: Tape and Reel
C7 C8 = CMP-2006-02520-2: Chip Multilayer Ceramic Capacitors for General Purpose, 0603, 10uF, X5R, 15%, 20%, 25V; Tolerance: 20%; Resistor Type: Ceramic; Voltage: 25V; Max Operating Temperature: 85°C; Min Operating Temperature: -55°C; Capacitance: 10uF; Dielectric: X5R; Lead Free: Lead Free; REACH SVHC: No SVHC; Case/Package: 0603; Mount: Surface Mount; Voltage Rating (DC): 25V; Height: 0.8mm; Length: 1.6mm; Thickness: 0.031inch; Width: 0.031inch; Termination: SMD/SMT; Case Code (Imperial): 0603; Case Code (Metric): 1608; Package Quantity: 1; Packaging: Tape and Reel; Depth: 0.8mm; Voltage Rating: 25V; Weight: 0.000222oz; Number of Pins: 2
C9 = CMP-2000-05439-1: as C3 on sheet Main; Case Size/Dimension: 0402; Tolerance (%): ±10%; Manufacturer URL: http://www.samsungsem.com/global/index.jsp; Datasheet URL: https://datasheet.ciiva.com/29198/458718-da-01-en-vs-kondensator-0402-29198423.pdf; Datasheet Version: Nov-10
D1 = CMP-22017-000005-2: LED GREEN CLEAR CHIP SMD; Dominant Wavelength: 569nm; Reverse Voltage: 5V; Lens Color: Colorless; Viewing Angle: 130°; Voltage: 2V; Forward Current: 30mA; Power Dissipation: 100mW; Luminous Intensity: 6mcd; Number of LEDs: 1; Forward Voltage: 2.1V; Wavelength: 565nm; Test Current: 10mA; Min Operating Temperature: -55°C; Lens Style: Clear; Mount: Surface Mount; Width: 0.8mm; Packaging: Tape and Reel; Lens Transparency: Clear; Case Code (Metric): 1608; Depth: 0.8mm; Case Code (Imperial): 0603; Case/Package: 0603; Number of Pins: 2; Max Operating Temperature: 85°C; Lead Free: Lead Free; Number of Elements: 1; Length: 1.6mm; Height: 0.8mm; Package Quantity: 1; Power Rating: 100mW; Radiation Hardening: No; Illumination Color: Green; Color: Green
D2 = CMP-22017-000025-1: LED YELLOW CLEAR SMD; Dominant Wavelength: 597nm; Power Rating: 75mW; Number of LEDs: 1; Lens Style: Diffused; Forward Current: 30mA; Test Current: 20mA; Forward Voltage: 2.4V; Wavelength: 588nm; Viewing Angle: 130°; Lens Color: Colorless; Reverse Voltage: 5V; Luminous Intensity: 180mcd; Case Code (Imperial): 0603; Width: 0.8mm; Power Dissipation: 75mW; Length: 1.6mm; Illumination Color: Yellow; Number of Pins: 2; Case Code (Metric): 1608; Mount: Surface Mount; Number of Elements: 1; Height: 0.55mm; Lens Transparency: Clear; Depth: 0.8mm; Min Operating Temperature: -55°C; Case/Package: 0603; Radiation Hardening: No; Max Operating Temperature: 85°C; Package Quantity: 1; Packaging: Tape and Reel; Lead Free: Lead Free; Color: Yellow
D3 = CMP-0303-00003-3: DIODE SCHOTTKY 40V 1A SOD123; Forward Voltage: 450mV; Capacitance: 110pF; Max Forward Surge Current (Ifsm): 25A; Peak Reverse Current: 50uA; Polarity: Standard; Element Configuration: Single; Max Power Dissipation: 450mW; Min Operating Temperature: -65°C; Package Quantity: 3000; Contact Plating: Tin; Weight: 0.000353oz; Max Repetitive Reverse Voltage (Vrrm): 40V; Max Reverse Voltage (DC): 40V; Height: 1.25mm; Average Rectified Current: 1A; Width: 1.7mm; Case/Package: SOD-123-2; Lead Free: Lead Free; Max Operating Temperature: 125°C; Current Rating: 1A; Termination: SMD/SMT; Forward Current: 1A; Radiation Hardening: No; Number of Pins: 2; Length: 2.85mm; Voltage Rating (DC): 40V; REACH SVHC: No SVHC; Peak Non-Repetitive Surge Current: 25A; Packaging: Tape and Reel; Output Current: 1A
J2 = S2B-ZR-SM4A-TF(LF)(SN): as J1 on sheet I2C_OLED_DRV2605; SnapEDA_Link: https://www.snapeda.com/parts/S2B-ZR-SM4A-TF%20(LF)(SN)/JST/view-part/?ref=snap; Package: None; Value: *; MP: S2B-ZR-SM4A-TF (LF)(SN); Check_prices: https://www.snapeda.com/parts/S2B-ZR-SM4A-TF%20(LF)(SN)/JST/view-part/?ref=eda
Q1 = CMP-32901-000130-1: MOSFET P-CH 20V 3.7A SOT-23; Manufacturer: Infineon; Reverse Recovery Time: 29ns; Max Forward Diode Voltage: -1.2V; Input Capacitace At Vds: 633pF @ -10V; Drain To Source Resistance: 0.05Ω; Gate To Source Voltage: 12V; Max Junction Temp: +150°C; Pulse Drain Current: -22A; Threshold Vgs Min: -0.4V; Turn Off Delay Time: 588ns; Number Of Channels: 1; Power Dissipation: 1.3W; Turn On Delay Time: 350ns; Drain To Source Breakdown Voltage: -20V; Continuous Drain Current: -3.7A; Depletion Mode: False; Gate Charge At Vgs: 8nC @ -5V; Rthja Max: 75°C/W; Threshold Vgs: -0.55V; Standoff Height: 0.01mm; Reverse Recovery Charge: 11nC; Device Class L2: Transistors; Ipc Land Pattern Name: SOT95P237X100-3; Temperature Range High: +150°C; Octopart: https://octopart.com/irlml6402trpbf-infineon-65874989; ComponentLink2URL: https://www.infineon.com/dgdl/irlml6402pbf.pdf?fileId=5546d462533600a401535668d5c2263c; Automotive: No; Manufacturer Part Number: IRLML6402TRPBF; Height: 1.12mm; Drain To Source Voltage: -20V; Digikey Description: MOSFET P-CH 20V 3.7A SOT-23; Device Class L1: Discrete Semiconductors; Package: Micro3; Lead Free: Yes; Temperature Range Low: -55°C; Number Of P Channels: 1; Technology: MOSFET; Temperature: -55°C to +150°C; Category: Trans; Footprint Url: http://irf.com/package/outline/po_micro3.pdf; RoHS: TRUE; Device Class L3: MOSFETs; Threshold Vgs Max: -1.2V; ComponentLink2Description: Datasheet
R4 R6 = CMP-2000-04836-2: RES 2kΩ 1.00% 0.1W 0603; Resistance: 2kR; Voltage Rating: 50V; Max Power Dissipation: 100mW; Temperature Coefficient: 100ppm/°C; Tolerance: 1%; Height: 0.45mm; Case Code (Imperial): 0603; Number of Terminations: 2; Termination: SMD/SMT; Max Operating Temperature: 155°C; Min Operating Temperature: -55°C; Features: Moisture Resistant; Size Code: 0603; Military Standard: Not; Depth: 0.8mm; Lead Free: Lead Free; Ratings: AEC-Q200; Case Code (Metric): 1608; Power Rating: 100mW; Resistor Type: Thick Film; Length: 1.6mm; Case/Package: 0603; Packaging: Tape and Reel; Width: 0.8mm; Construction: Rectangular; Series: AC
R5 R7 = CMP-03412-025080-2: as R27 on sheet USB_UART; Max Operating Temperature: 155°C; Min Operating Temperature: -55°C; Ratings: AEC-Q200; Features: Moisture Resistant; RoHS Compliant: Yes; Number of Terminations: 2; Weight: 7.1E-05oz; Case Code (Imperial): 0603; Resistor Type: Thick Film; Length: 1.6mm; Termination: SMD/SMT; Case Code (Metric): 1608; Packaging: Tape and Reel; Width: 0.8mm; Series: AC; Case/Package: 0603; Power Rating: 100mW; Height: 0.45mm
R8 R9 = CMP-03412-037786-1: RES SMD 200K OHM 1% 1/10W 0603; Temperature Coefficient: 100ppm/°C; Voltage Rating: 50V; Resistance: 200kR; Max Power Dissipation: 100mW; Packaging: Tape and Reel; REACH SVHC: No SVHC; Resistance Tolerance: 1%; Number of Pins: 2; Width: 0.031inch; Termination: SMD/SMT; Features: Moisture Resistant; Tolerance: 1%; Series: RC; Case Code (Imperial): 0603; Depth: 0.8mm; Number of Terminations: 2; Max Operating Temperature: 155°C; Resistor Type: Thick Film; Height: 0.022inch; Lead Free: Lead Free; Construction: Rectangular; Case/Package: 0603; Power Rating: 100mW; Case Code (Metric): 1608; Length: 1.6mm; Size Code: 0603; RoHS Compliant: Yes; Military Standard: Not; Min Operating Temperature: -55°C; Package Quantity: 1; Voltage Rating (DC): 50V
R10 = CMP-2000-04816-3: RES 100KΩ 1.00% 0.1W 0603; Temperature Coefficient: 100ppm/°C; Voltage Rating: 50V; Max Power Dissipation: 100mW; Tolerance: 1%; Working Voltage: 75V; Resistance: 100kR; Min Operating Temperature: -55°C; Case Code (Imperial): 0603; Width: 0.031inch; Max Operating Temperature: 155°C; Military Standard: Not; Technology: THICK FILM; Ratings: AEC-Q200; Features: Moisture Resistant; Construction: Rectangular; Resistor Type: Thick Film; RoHS Compliant: Yes; Case Code (Metric): 1608; Termination: SMD/SMT; Series: AC; Lead Free: Lead Free; Length: 1.6mm; Depth: 0.8mm; Height: 0.022inch; Power Rating: 100mW; Package Quantity: 1; Packaging: Tape and Reel; Case/Package: 0603; Number of Terminations: 2; Moisture Sensitivity Level: 1
SW1 = CMP-10038-000008-2: SWITCH SLIDE DPDT 300MA 6V; Actuator Material: Nylon; Actuator Type: Standard; Electrical Life: 5000Cycles; Actuator Length: 2mm; Switch Function: On-On; Throw Configuration: DPDT; Switch Travel: 2mm; Min Operating Temperature: -40°C; Contact Material: Copper Alloy; Mount: Surface Mount; Voltage Rating (DC): 6V; Max Operating Temperature: 85°C; Current Rating: 300mA; Packaging: Cut Tape; Contact Plating: Silver
U3 = CMP-0133-00143-2: IC CONTROLLR LI-ION 4.2V SOT23-5; Max Power Dissipation: 1.54W; Output Current: 500mA; Max Output Voltage: 4.5V; Number of Outputs: 1; Min Output Voltage: 4.168V; Min Supply Voltage: 3.75V; Max Input Voltage: 6V; Voltage Rating: 4.534V; Drain to Source Resistance: 350mR; Max Operating Temperature: 85°C; Length: 0.122inch; Number of Pins: 5; REACH SVHC: No SVHC; Radiation Hardening: No; Min Operating Temperature: -40°C; Weight: 0.00709oz; Contact Plating: Tin; Termination: SMD/SMT; Case/Package: SOT-23; Mount: Surface Mount; Width: 0.071inch; Packaging: Tape and Reel; Number of Cells: 1; Max Charge Current: 500mA; Height: 0.051inch; Number of Channels: 1; Output Voltage: 4.2V; Max Supply Voltage: 6V; Lead Free: Lead Free
U4 = WS2812C-2020: Intelligent control LED integrated light source; MF: Worldsemi; SnapEDA_Link: https://www.snapeda.com/parts/WS2812C-2020/Worldsemi/view-part/?ref=snap; Package: Package; Value: *; MP: WS2812C-2020; Check_prices: https://www.snapeda.com/parts/WS2812C-2020/Worldsemi/view-part/?ref=eda
U5 = CMP-1679-00010-1: Low-Dropout Positive Fixed Voltage Regulator, 1 A, 3.3 V Output Voltage, 0 to 125 degC, 4-Pin SOT-223 (318H-01), Pb-Free, Tape and Reel; Resistance: 220 kohm; Type (Resistor): Thick Film; Voltage Rating: 75 V; Tolerance: 1%; Case\Package: 0603; Power Rating: 100 mW; Width: 0.85 mm; Weight: 7.1E-05 oz; ComponentLink2URL: http://www.onsemi.com/pub_link/Collateral/NCP1117-D.PDF; RoHSCompliant: true; Height: 0.45 mm; PackageDescription: 4-Pin Small Outline Transistor, Body 6.5 x 3.5 mm, Pitch 2.3 mm; ComponentLink1Description: Manufacturer URL; ComponentLink1URL: http://www.onsemi.com/; PackageReference: SOT-223-4-318H-01_A; Max Operating Temperature: 155 degC; Packaging: Tape and Reel; REACH SVHC: Unknown; Length: 1.55 mm; Package Quantity: 5000; Radiation Hardening: No; Min Operating Temperature: -55 degC; DatasheetVersion: Rev. 27, 09/2014; Mount: Surface Mount; Case Code (Imperial): 0603; Case Code (Metric): 1608; ComponentLink2Description: Datasheet

## Nets that join several sheets
3V3: Main (C3.2 C4.1 MD1.2), I2C_OLED_DRV2605 (6 pins), Menu_Navigators (R11.2 R12.2 R13.2), USB_UART (6 pins), VOLTAGE_REGULATOR (R7.2 SW1.7)
GND: Main (6 pins), I2C_OLED_DRV2605 (C1.2 C2.2 U1.8 U2.1), Menu_Navigators (9 pins), USB_UART (26 pins), VOLTAGE_REGULATOR (11 pins)
VCC: USB_UART (C17.2 D6.1 R14.1 R21.1), VOLTAGE_REGULATOR (7 pins)
EN: Main (MD1.3), USB_UART (C13.2 Q2.3 R15.1 S1.2)
IO0: Main (MD1.25), USB_UART (R20.2)
IO4: Main (MD1.26), VOLTAGE_REGULATOR (U4.3)
IO23: Main (MD1.37), USB_UART (R25.1)
IO27: Main (MD1.12), Menu_Navigators (C10.1 R11.1 SW2.2)
IO33: Main (MD1.9), I2C_OLED_DRV2605 (R1.2)
IO34: Main (MD1.6), Menu_Navigators (C12.1 R13.1 SW4.2)
IO35: Main (MD1.7), Menu_Navigators (C11.1 R12.1 SW3.2)
RXD0: Main (MD1.34), USB_UART (R24.1)
SCL: Main (MD1.36), I2C_OLED_DRV2605 (R3.1 U1.2 U2.3)
SDA: Main (MD1.33), I2C_OLED_DRV2605 (R2.1 U1.3 U2.4)
TXD0: Main (MD1.35), USB_UART (R22.1)